# EAGLE design mini_Quad_v01.1_L (EAGLE 9.0.1)
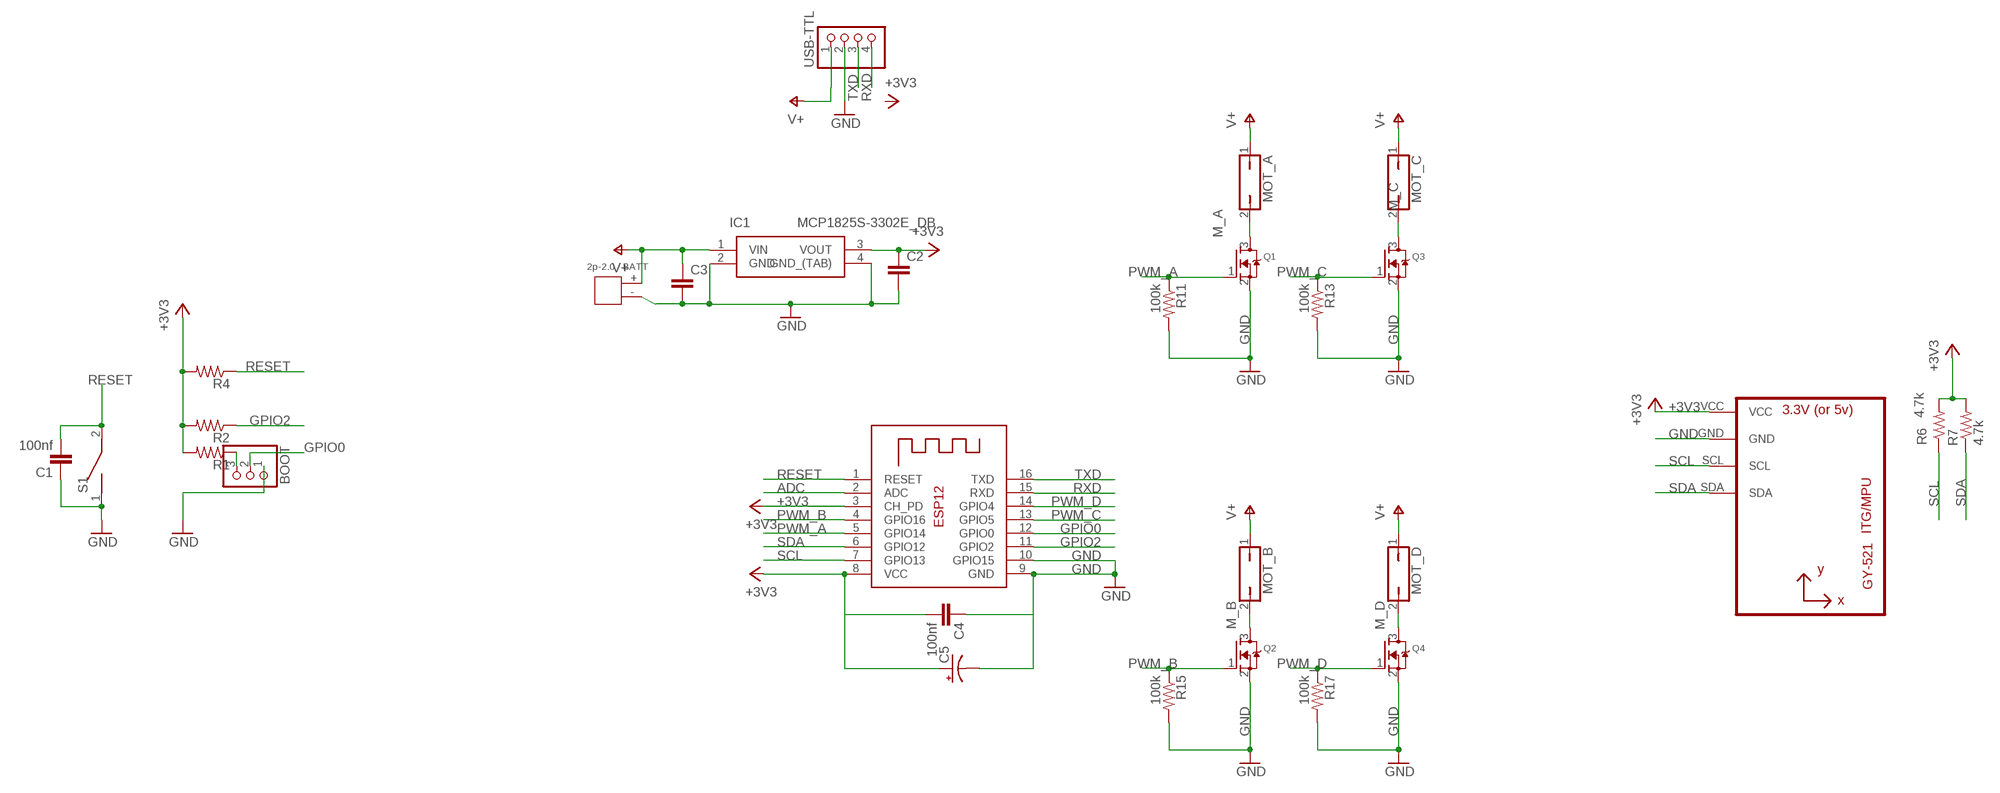
[diagram p0: schematic, sheet 1]

## Parts
BATT  2p-2.0  DIP-JST-2P-2.0  [H2-2.0-6X4.5MM]
BOOT  PINHD-1X3  [1X03]
C1  100nf  C-EUC1206K  [C1206K]
C2  C-EUC1206K  [C1206K]
C3  C-EUC1206K  [C1206K]
C4  100nf  C-EU050-024X044  [C050-024X044]
C5  CPOL-USB/3528-21W  [B/3528-21W]
ESP12-E  ESP-12  [ESP-12]
IC1  MCP1825S-3302E_DB  [SOT230P700X180-4N]
MOT_A  JP1Q  [JP1]
MOT_B  JP1Q  [JP1]
MOT_C  JP1Q  [JP1]
MOT_D  JP1Q  [JP1]
Q1  MOSFET-NTO252  [TO252]
Q2  MOSFET-NTO252  [TO252]
Q3  MOSFET-NTO252  [TO252]
Q4  MOSFET-NTO252  [TO252]
R1  R-US_R1206W  [R1206W]
R2  R-US_0204/5  [0204/5]
R4  R-US_0204/7  [0204/7]
R6  4.7k  R-US_0204/5  [0204/5]
R7  4.7k  R-US_0204/7  [0204/7]
R11  100k  R-US_0204/5  [0204/5]
R13  100k  R-US_0204/5  [0204/5]
R15  100k  R-US_0204/5  [0204/5]
R17  100k  R-US_0204/5  [0204/5]
S1  DS01  [DS-01]
U1  GY-521MPU6050  [GY-521]
USB-TTL  PINHD-1X4  [1X04]

## Nets
+3V3 [3.3v]: C2.1 C4.2 C5.+ ESP12-E.3(CH_PD) ESP12-E.8(VCC) IC1.3(VOUT) R1.2 R2.2 R4.2 R6.2 R7.2 U1.VCC
ADC: ESP12-E.2(ADC)
GND [gnd]: BATT.- BOOT.1 C1.1 C2.2 C3.2 C4.1 C5.- ESP12-E.9(GND) ESP12-E.10(GPIO15) IC1.2(GND) IC1.4(GND_(TAB)) Q1.2(S) Q2.2(S) Q3.2(S) Q4.2(S) R11.2 R13.2 R15.2 R17.2 S1.1 U1.GND USB-TTL.2
GPIO0: BOOT.2 ESP12-E.12(GPIO0)
GPIO2: ESP12-E.11(GPIO2) R2.1
M_A [power]: MOT_A.2 Q1.3(D)
M_B [power]: MOT_B.2 Q2.3(D)
M_C [power]: MOT_C.2 Q3.3(D)
M_D: MOT_D.2 Q4.3(D)
N$1: BOOT.3 R1.1
PWM_A: ESP12-E.5(GPIO14) Q1.1(G) R11.1
PWM_B: ESP12-E.4(GPIO16) Q2.1(G) R15.1
PWM_C: ESP12-E.13(GPIO5) Q3.1(G) R13.1
PWM_D: ESP12-E.14(GPIO4) Q4.1(G) R17.1
RESET: C1.2 ESP12-E.1(RESET) R4.1 S1.2
RXD: ESP12-E.15(RXD) USB-TTL.4
SCL: ESP12-E.7(GPIO13) R6.1 U1.SCL
SDA: ESP12-E.6(GPIO12) R7.1 U1.SDA
TXD: ESP12-E.16(TXD) USB-TTL.3
V+ [power]: BATT.+ C3.1 IC1.1(VIN) MOT_A.1 MOT_B.1 MOT_C.1 MOT_D.1 USB-TTL.1

## Library data of the parts
BATT = mini_Quad_v01.1_L:DIP-JST-2P-2.0: 320110049
BOOT = mini_Quad_v01.1_L:PINHD-1X3: PIN HEADER
C1-C4 = mini_Quad_v01.1_L:C-EU: CAPACITOR, European symbol; SPICEPREFIX: C
C5 = mini_Quad_v01.1_L:CPOL-US: POLARIZED CAPACITOR, American symbol
ESP12-E = mini_Quad_v01.1_L:ESP-12
IC1 = mini_Quad_v01.1_L:MCP1825S-3302E_DB: LDO Regulator 500mA 3.3V SOT223-3 Microchip MCP1825S-3302E/DB, LDO Voltage Regulator, 0.5A, 3.3 V 0.5%, 2.1 6 Vin, 4-Pin SOT-223 Source: Datasheet <http://docs-europe.electrocomponents.com/webdocs/137e/0900766b8137ed40.pdf>; ALLIED_NUMBER: 70046538; ARROW_PART_NUMBER: MCP1825S-3302E/DB; DESCRIPTION: LDO Regulator 500mA 3.3V SOT223-3 Microchip MCP1825S-3302E/DB, LDO Voltage Regulator, 0.5A, 3.3 V 0.5%, 2.1 6 Vin, 4-Pin SOT-223; HEIGHT: 1.8mm; MANUFACTURER_NAME: Microchip; MANUFACTURER_PART_NUMBER: MCP1825S-3302E/DB; RS_PART_NUMBER: 9115520
MOT_A MOT_B MOT_C MOT_D = mini_Quad_v01.1_L:JP1Q: JUMPER
Q1-Q4 = mini_Quad_v01.1_L:MOSFET-N: N-Channel Mosfet 2N7002E - 60V 260mA SOT23 [Digikey: 2N7002ET1GOSTR-ND] - REEL BSH103 - 30V 850mA SOT23 [Digikey: 568-5013-1-ND]
R1 R2 R4 R6 R7 R11 R13 R15 R17 = mini_Quad_v01.1_L:R-US_: RESISTOR, American symbol; SPICEPREFIX: R
S1 = mini_Quad_v01.1_L:DS01: DIL/CODE SWITCH; OC_FARNELL: unknown; OC_NEWARK: unknown
U1 = mini_Quad_v01.1_L:GY-521
USB-TTL = mini_Quad_v01.1_L:PINHD-1X4: PIN HEADER

## Net classes
1 power: width 1.27 mm
2 gnd: width 0.762 mm
3 3.3v: width 0.762 mm

## Board
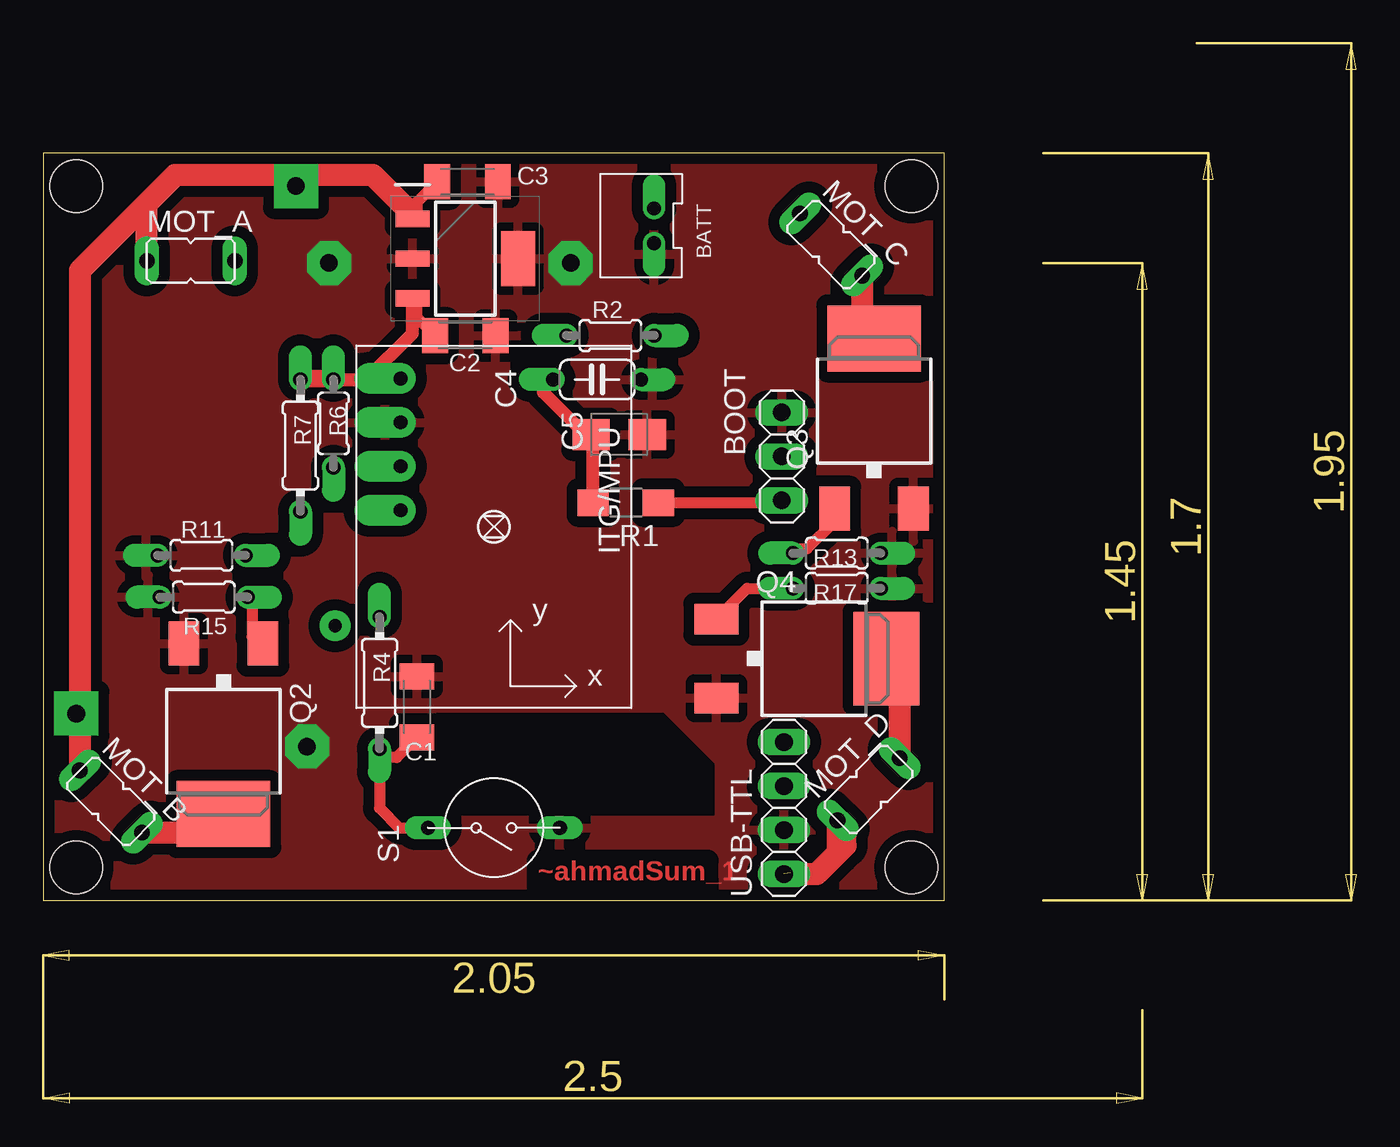
[diagram p1: board, top side]
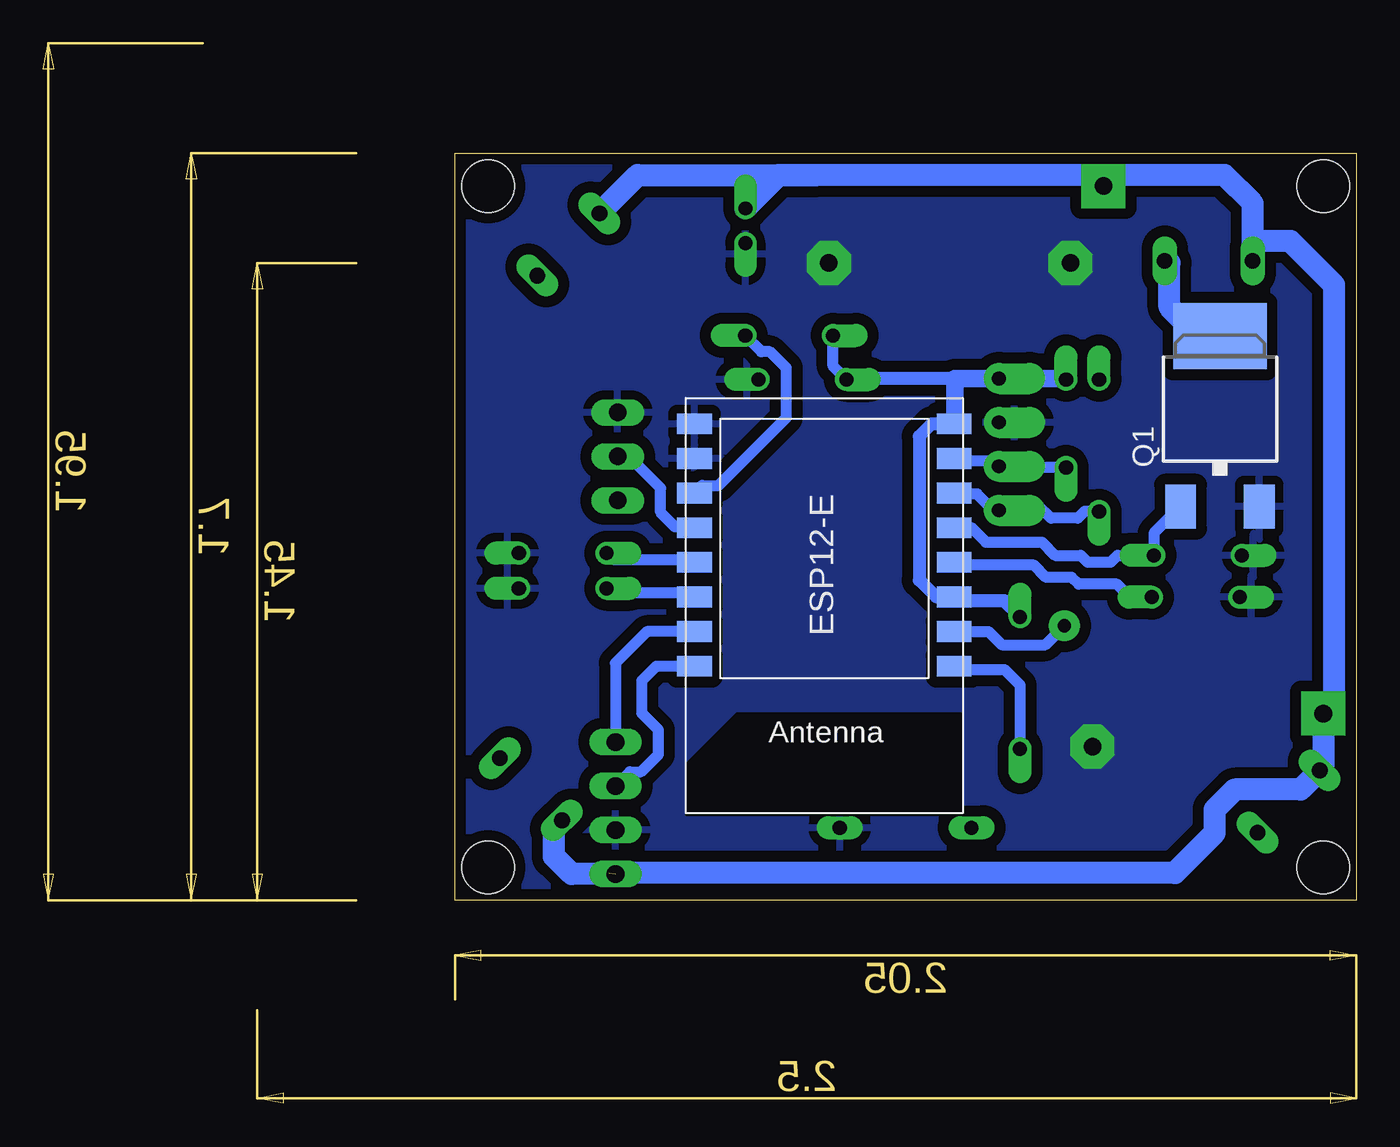
[diagram p2: board, bottom side, seen from below]

Size 52.07 x 43.18 mm. Coordinates in mm from the lower left corner, seen from the top.
Outline: 0,0 52.07,0 52.07,43.18 0,43.18 0,0
Copper layers (1*16): Top 0.035mm / dielectric 1.5mm / Bottom 0.035mm
Design rules "default_25th": minimum track width 25mil, minimum drill 30mil, track to track 25mil, track to pad 25mil, pad to pad 25mil, via to via 25mil, smd to smd 6mil, copper to edge 25mil, drill to drill 30mil, minimum pad ring 10mil, minimum via ring 8mil, stop-mask expansion 4mil, vias tented up to drill 0mil, thermal gap 20mil
Holes 3 mm at 50.16,41.27 50.16,1.91 1.91,1.91 1.91,41.27

### Footprints (pad centres in the part's own frame; a part is rotated, then mirrored left to right if it is on the bottom)
H2-2.0-6X4.5MM = drill 0.8 pad 1.3 offset: + -1,0.75; - 1,0.75
1X03 = drill 1.016 long: 1 -2.54,0; 2 0,0; 3 2.54,0
C1206K = smd 1.5 x 2: 1 -1.754,0; 2 1.754,0
C050-024X044 = drill 0.813 offset: 1 -2.54,0; 2 2.54,0
B/3528-21W = smd 2.15 x 1.8: + 1.625,0; - -1.625,0
ESP-12 = smd 2 x 1.2: 1 -7.5,4.5; 2 -7.5,2.5; 3 -7.5,0.5; 4 -7.5,-1.5; 5 -7.5,-3.5; 6 -7.5,-5.5; 7 -7.5,-7.5; 8 -7.5,-9.5; 9 7.5,-9.5; 10 7.5,-7.5; 11 7.5,-5.5; 12 7.5,-3.5; 13 7.5,-1.5; 14 7.5,0.5; 15 7.5,2.5; 16 7.5,4.5
SOT230P700X180-4N = smd 1.95 x 0.95: 1 -3.05,2.3; 2 -3.05,0; 3 -3.05,-2.3 | smd 1.95 x 3.2: 4 3.05,0
JP1 = drill 0.914 long: 1 0,-2.54; 2 0,2.54
TO252 = smd 1.778 x 2.54: 1 -2.28,-4.8; 2 2.28,-4.8 | smd 5.4 x 3.81: 3 0,5.04
R1206W = smd 1.8 x 1.524: 1 -1.88,0; 2 1.88,0
0204/5 = drill 0.813 offset: 1 -2.54,0; 2 2.54,0
0204/7 = drill 0.813 offset: 1 -3.81,0; 2 3.81,0
DS-01 = drill 0.813 long: 1 0,-3.81; 2 0,3.81
GY-521 = drill 0.8 pad 1.778 offset: GND -5.397,6.032; SCL -5.397,3.493; SDA -5.397,0.953; VCC -5.397,8.572
1X04 = drill 1.016 long: 1 -3.81,0; 2 -1.27,0; 3 1.27,0; 4 3.81,0

### Placement (x,y rotation side)
BATT  34.54,38.99 270 top
BOOT  42.67,25.65 270 top
C1  21.59,11.18 270 top
C2  24.38,32.64 0 top
C3  24.51,41.53 0 top
C4  32,30.1 180 top
C5  33.27,26.92 180 top
ESP12-E  30.73,18.03 180 bottom
IC1  24.38,37.08 0 top
MOT_A  8.53,36.96 270 top
MOT_B  3.91,5.71 225 top
MOT_C  45.52,37.9 225 top
MOT_D  47.69,6.42 315 top
Q1  7.87,27.56 0 bottom
Q2  10.41,10.03 180 top
Q3  48.01,27.43 0 top
Q4  43.69,13.97 270 top
R1  33.66,22.99 180 top
R2  32.77,32.64 180 top
R4  19.43,12.57 90 top
R6  16.76,27.56 90 top
R7  14.86,26.29 90 top
R11  9.14,19.94 180 top
R13  45.85,20.07 0 top
R15  9.27,17.53 180 top
R17  45.85,18.03 0 top
S1  26.04,4.19 90 top
U1  26.04,21.59 0 top
USB-TTL  42.8,5.33 90 top

### Tracks (layer width: path | path; a pad name or v marks a point on that pad's centre or on a via)
+3V3
  Top 0.635: C2.1 21.59,33.68 21.59,34.53 IC1.3
  Top 0.762: R1.2 31.75,23.02 31.75,26.83 C5.+ 31.27,26.99 28.89,29.37 28.89,29.69 29.37,30.16 C4.2 | 14.92,30.16 R7.2 | 16.67,30.16 R6.2 18.67,30.1 21.33,32.76 IC1.3
  Top 1.016: 16.67,30.16 14.92,30.16
  Bottom 0.635: C4.2 30.23,30.86 R2.2
  Bottom 0.762: R4.2 19.53,16.51 20.32,17.3 23.02,17.3 23.18,17.46 ESP12-E.3 24.27,17.53 25.25,18.51 25.25,26.82 24.54,27.53 ESP12-E.8 23.18,27.62 | C4.2 29.37,30.16 23.5,30.16 23.18,30.16 | 20.32,30.16 U1.VCC | 16.83,30.16 R6.2
  Bottom 1.016: 23.18,27.62 23.18,30.16 U1.VCC | 16.83,30.16 20.32,30.16
ADC  (via drill 0.76 pad 1.78)
  Bottom 0.635: ESP12-E.2 21.25,15.53 20.48,14.77 17.97,14.77 v16.87,15.88
GND  (via drill 1.02 pad 2.54)
  other vias: 15.24,8.89 16.51,36.83 30.48,36.83
  pour Bottom: -12.7,73.66 -12.7,-7.62 104.14,-7.62 104.14,73.66
  pour Top: -5.08,81.28 76.2,81.28 76.2,-17.78 -5.08,-17.78
GPIO0
  Bottom 0.635: ESP12-E.12 38.29,21.59 39.37,21.59 40.2,22.42 40.2,23.82 41.91,25.54 41.91,26.04 42.29,26.04 BOOT.2
GPIO2
  Bottom 0.635: ESP12-E.11 37.79,23.98 36.84,23.98 32.93,27.89 32.93,30.77 33.88,31.71 34.38,31.71 R2.1
M_A
  Bottom 1.27: MOT_A.2 10.79,36.83 10.79,34.29 9.21,32.7 Q1.3
M_B
  Top 1.27: MOT_B.2 9.34,3.92 Q2.3
M_C
  Top 1.27: Q3.3 47.94,32.07 47.32,32.69 MOT_C.2
M_D
  Top 0.635: Q4.3 48.58,13.97
  Top 1.27: MOT_D.2 49.49,12.96 Q4.3
N$1
  Top 0.635: R1.1 42.55,22.99 BOOT.3
PWM_A
  Bottom 0.635: ESP12-E.5 22.23,21.53 21.4,20.7 18.16,20.7 17.4,19.94 15.92,19.94 15.53,19.55 14.19,19.55 13.8,19.94 R11.1 11.68,21.23 Q1.1
PWM_B
  Top 0.635: Q2.1 12.38,14.92 12.06,15.24 12.06,17.46 R15.1
  Bottom 0.635: ESP12-E.4 23.18,19.37 18.62,19.37 17.93,18.67 16.45,18.67 16.05,18.27 13.83,18.27 13.34,17.78 12.06,17.78 R15.1
PWM_C
  Top 0.635: Q3.1 45.72,21.91 44.13,20.32 43.5,20.32 R13.1
  Bottom 0.635: ESP12-E.13 38.42,19.68 42.86,19.68 43.18,20 R13.1
PWM_D
  Top 0.635: Q4.1 40.67,18.03 R17.1
  Bottom 0.635: ESP12-E.14 38.42,17.78 43.18,17.78 R17.1
RESET
  Top 0.635: C1.2 20.42,8.26 19.37,8.26 19.37,8.57 R4.1 19.43,5.33 20.57,4.19 S1.2
  Bottom 0.635: ESP12-E.1 23.18,13.34 20.32,13.34 19.43,12.45 R4.1
RXD
  Bottom 0.635: ESP12-E.15 40.98,15.53 42.8,13.72 USB-TTL.4
SCL
  Bottom 0.635: ESP12-E.7 23.18,25.4 20.95,25.4 U1.SCL 20.57,25.02 R6.1
SDA
  Bottom 0.635: ESP12-E.6 23.18,23.5 21.91,23.5 20.95,22.54 U1.SDA 20.32,22.86 18.41,22.86 17.64,22.09 16.1,22.09 15.7,22.48 R7.1
TXD
  Bottom 0.635: 38.42,13.34 ESP12-E.16 40.44,13.53 41.27,12.7 41.27,10.81 40.32,9.85 40.32,8.43 41.33,7.43 41.97,7.43 USB-TTL.3
V+  (via drill 1.02 pad 2.54)  (1 unrouted)
  Top 0.635: 21.33,39.63 IC1.1 21.35,39.37 21.59,39.37 21.59,40.36 C3.1
  Top 1.27: 6.35,40.64 7.62,41.91 13.97,41.91 v14.61,41.27 14.61,41.91 19.05,41.91 21.33,39.63 | 6.35,40.64 2.11,36.4 MOT_B.1 | MOT_A.1 5.99,40.28 6.35,40.64 | 44.7,1.52 46.35,3.17 46.35,3.81 | MOT_D.1 45.9,2.72 44.7,1.52 | USB-TTL.1 44.7,1.52
  Bottom 1.27: 6.03,37.15 MOT_A.1 5.99,38.1 | 5.99,38.1 5.99,40.28 7.62,41.91 13.97,41.91 v14.61,41.27 15.24,41.91 31.11,41.91 | BATT.+ 33.37,41.91 31.11,41.91 | MOT_D.1 46.35,4.16 46.35,2.54 45.34,1.52 USB-TTL.1 | 43.18,1.59 10.48,1.59 8.19,3.88 8.19,5.24 7.03,6.4 3.22,6.4 MOT_B.1 1.91,7.72 v1.91,10.79 1.27,11.43 1.27,35.56 3.81,38.1 5.99,38.1 | MOT_C.1 41.52,41.91 31.11,41.91

### Text on the board
Top: ~ahmadSum_1